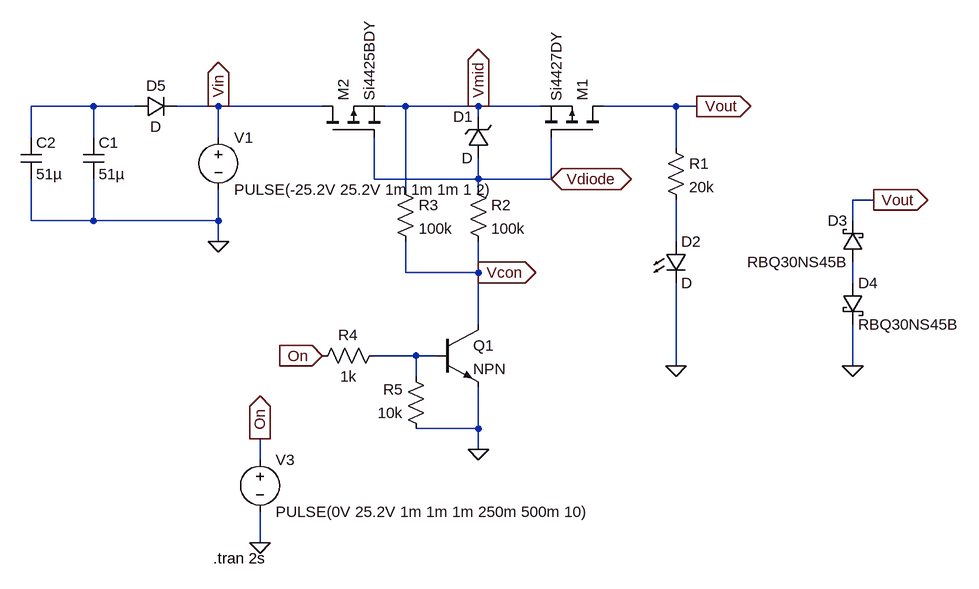
[diagram p0: schematic reverse_polarity.asc]
reverse_polarity.asc, the LTspice schematic file:
Version 4
SHEET 1 880 720
WIRE -816 -32 -912 -32
WIRE -752 -32 -816 -32
WIRE -624 -32 -688 -32
WIRE -464 -32 -624 -32
WIRE -336 -32 -368 -32
WIRE -224 -32 -336 -32
WIRE -128 -32 -224 -32
WIRE 80 -32 -32 -32
WIRE 112 -32 80 -32
WIRE -224 -16 -224 -32
WIRE -912 16 -912 -32
WIRE -816 16 -816 -32
WIRE -624 16 -624 -32
WIRE 80 32 80 -32
WIRE -384 80 -384 16
WIRE -224 80 -224 48
WIRE -224 80 -384 80
WIRE -112 80 -112 16
WIRE -112 80 -224 80
WIRE -336 96 -336 -32
WIRE -224 96 -224 80
WIRE 384 112 352 112
WIRE -912 144 -912 80
WIRE -816 144 -816 80
WIRE -816 144 -912 144
WIRE -624 144 -624 96
WIRE -624 144 -816 144
WIRE 352 144 352 112
WIRE -624 176 -624 144
WIRE 80 176 80 112
WIRE -336 224 -336 176
WIRE -224 224 -224 176
WIRE -224 224 -336 224
WIRE 352 240 352 208
WIRE -224 304 -224 224
WIRE -320 352 -384 352
WIRE -288 352 -320 352
WIRE 80 368 80 240
WIRE 352 368 352 304
WIRE -320 384 -320 352
WIRE -224 464 -224 400
WIRE -224 464 -320 464
WIRE -224 496 -224 464
WIRE -560 512 -560 480
WIRE -560 640 -560 592
FLAG -224 496 0
FLAG -624 176 0
FLAG -464 352 On
IOPIN -464 352 In
FLAG -560 480 On
IOPIN -560 480 Out
FLAG -560 640 0
FLAG 80 368 0
FLAG 112 -32 Vout
IOPIN 112 -32 Out
FLAG -112 80 Vdiode
IOPIN -112 80 BiDir
FLAG -224 -32 Vmid
IOPIN -224 -32 Out
FLAG -224 224 Vcon
IOPIN -224 224 Out
FLAG -624 -32 Vin
IOPIN -624 -32 Out
FLAG 384 112 Vout
IOPIN 384 112 Out
FLAG 352 368 0
SYMBOL pmos -32 16 M270
SYMATTR InstName M1
SYMATTR Value Si4427DY
SYMBOL pmos -464 16 R270
SYMATTR InstName M2
SYMATTR Value Si4425BDY
SYMBOL zener -208 48 R180
WINDOW 0 24 64 Left 2
WINDOW 3 24 0 Left 2
SYMATTR InstName D1
SYMBOL res 64 16 R0
SYMATTR InstName R1
SYMATTR Value 20k
SYMBOL res -240 80 R0
SYMATTR InstName R2
SYMATTR Value 100k
SYMBOL res -352 80 R0
SYMATTR InstName R3
SYMATTR Value 100k
SYMBOL LED 64 176 R0
SYMATTR InstName D2
SYMBOL npn -288 304 R0
SYMATTR InstName Q1
SYMBOL res -368 336 R90
WINDOW 0 0 56 VBottom 2
WINDOW 3 32 56 VTop 2
SYMATTR InstName R4
SYMATTR Value 1k
SYMBOL res -304 480 R180
WINDOW 0 36 76 Left 2
WINDOW 3 36 40 Left 2
SYMATTR InstName R5
SYMATTR Value 10k
SYMBOL voltage -624 0 R0
WINDOW 123 0 0 Left 0
WINDOW 39 0 0 Left 0
SYMATTR InstName V1
SYMATTR Value PULSE(-25.2V 25.2V 1m 1m 1m 1 2)
SYMBOL voltage -560 496 R0
WINDOW 123 0 0 Left 0
WINDOW 39 0 0 Left 0
SYMATTR InstName V3
SYMATTR Value PULSE(0V 25.2V 1m 1m 1m 250m 500m 10)
SYMBOL cap -832 16 R0
SYMATTR InstName C1
SYMATTR Value 51µ
SYMATTR SpiceLine V=50V
SYMBOL cap -928 16 R0
SYMATTR InstName C2
SYMATTR Value 51µ
SYMATTR SpiceLine V=50V
SYMBOL schottky 368 208 R180
WINDOW 0 24 64 Left 2
WINDOW 3 24 0 Left 2
SYMATTR InstName D3
SYMATTR Value RBQ30NS45B
SYMATTR Description Diode
SYMATTR Type diode
SYMBOL schottky 336 240 R0
SYMATTR InstName D4
SYMATTR Value RBQ30NS45B
SYMATTR Description Diode
SYMATTR Type diode
SYMBOL diode -752 -16 R270
WINDOW 0 32 32 VTop 2
WINDOW 3 0 32 VBottom 2
SYMATTR InstName D5
TEXT -632 664 Left 2 !.tran 2s

The netlist it stands for:
* reverse_polarity.asc
M1 Vout Vdiode Vmid Vmid Si4427DY
M2 Vin Vdiode Vmid Vmid Si4425BDY
D1 Vdiode Vmid D
R1 Vout N002 20k
R2 Vdiode Vcon 100k
R3 Vmid Vcon 100k
D2 N002 0 D
Q1 Vcon N004 0 0 NPN
R4 N004 On 1k
R5 0 N004 10k
V1 Vin 0 PULSE(-25.2V 25.2V 1m 1m 1m 1 2)
V3 On 0 PULSE(0V 25.2V 1m 1m 1m 250m 500m 10)
C1 N001 0 51µ V=50V
C2 N001 0 51µ V=50V
D3 N003 Vout RBQ30NS45B
D4 N003 0 RBQ30NS45B
D5 N001 Vin D
.model D D
.lib standard.dio
.model NPN NPN
.model PNP PNP
.lib standard.bjt
.model NMOS NMOS
.model PMOS PMOS
.lib standard.mos
.tran 2s
.backanno
.end